# EAGLE design node (EAGLE 7.6.0)
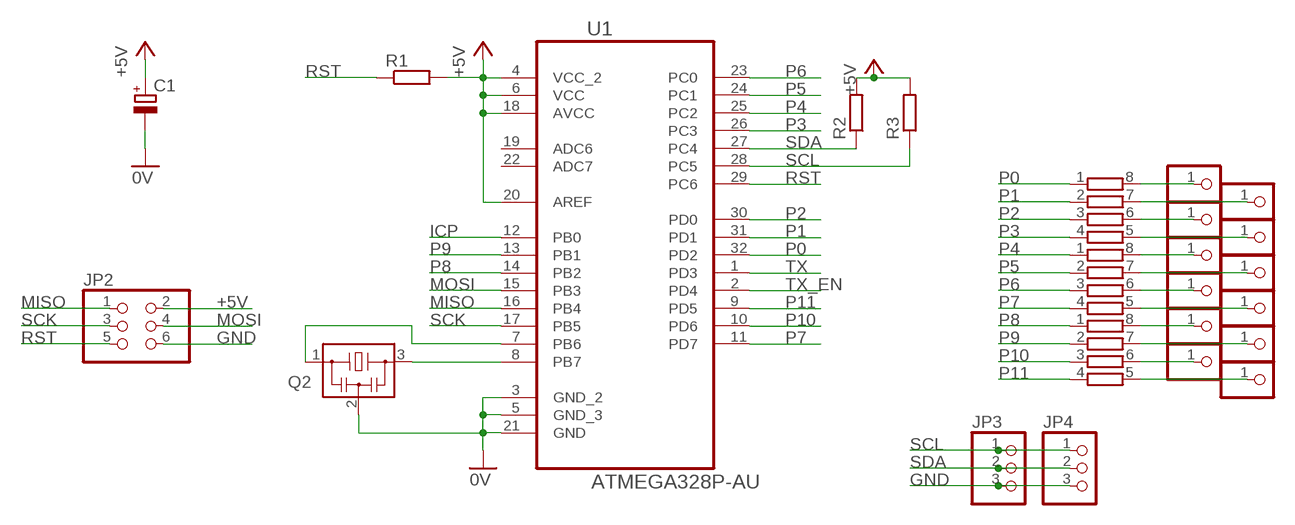
[diagram p0: schematic, sheet 1]

## Parts
C1  CPOL-EU153CLV-0405  [153CLV-0405]
JP1  PINHD-1X1  [1X01]
JP2  PINHD-2X3  [2X03]
JP3  PINHD-1X3  [1X03]
JP4  PINHD-1X3  [1X03]
JP6  PINHD-1X1  [1X01]
JP7  PINHD-1X1  [1X01]
JP8  PINHD-1X1  [1X01]
JP9  PINHD-1X1  [1X01]
JP10  PINHD-1X1  [1X01]
JP11  PINHD-1X1  [1X01]
JP12  PINHD-1X1  [1X01]
JP13  PINHD-1X1  [1X01]
JP14  PINHD-1X1  [1X01]
JP15  PINHD-1X1  [1X01]
JP16  PINHD-1X1  [1X01]
Q2  CSTCR6M00G53Z  [CSTCR6M]
R1  R-EU_R0402  [R0402]
R2  R-EU_R0402  [R0402]
R3  R-EU_R0402  [R0402]
RN1  4R-NEXB28V  [EXB28V]
RN2  4R-NEXB28V  [EXB28V]
RN3  4R-NEXB28V  [EXB28V]
U1  ATMEGA328P-AU  [QFP80P900X900X120-32N]

## Nets
+5V: C1.+ JP2.2 R1.2 R2.2 R3.2 U1.4(VCC_2) U1.6(VCC) U1.18(AVCC) U1.20(AREF)
GND: C1.- JP2.6 JP3.3 JP4.3 Q2.2 U1.3(GND_2) U1.5(GND_3) U1.21(GND) ; supply symbol labelled 0V
ICP: U1.12(PB0)
MISO: JP2.1 U1.16(PB4)
MOSI: JP2.4 U1.15(PB3)
N$1: Q2.3 U1.8(PB7)
N$2: Q2.1 U1.7(PB6)
N$3: JP1.1 RN1.8
N$4: JP16.1 RN1.7
N$5: JP6.1 RN1.6
N$6: JP15.1 RN1.5
N$7: JP7.1 RN2.8
N$8: JP14.1 RN2.7
N$9: JP8.1 RN2.6
N$10: JP13.1 RN2.5
N$11: JP9.1 RN3.8
N$12: JP12.1 RN3.7
N$13: JP10.1 RN3.6
N$14: JP11.1 RN3.5
P0: RN1.1 U1.32(PD2)
P1: RN1.2 U1.31(PD1)
P2: RN1.3 U1.30(PD0)
P3: RN1.4 U1.26(PC3)
P4: RN2.1 U1.25(PC2)
P5: RN2.2 U1.24(PC1)
P6: RN2.3 U1.23(PC0)
P7: RN2.4 U1.11(PD7)
P8: RN3.1 U1.14(PB2)
P9: RN3.2 U1.13(PB1)
P10: RN3.3 U1.10(PD6)
P11: RN3.4 U1.9(PD5)
RST: JP2.5 R1.1 U1.29(PC6)
SCK: JP2.3 U1.17(PB5)
SCL: JP3.1 JP4.1 R3.1 U1.28(PC5)
SDA: JP3.2 JP4.2 R2.1 U1.27(PC4)
TX: U1.1(PD3)
TX_EN: U1.2(PD4)
Unconnected: U1.19(ADC6) U1.22(ADC7)

## Library data of the parts
C1 = resistor:CPOL-EU: POLARIZED CAPACITOR, European symbol
JP1 JP6-JP16 = pinhead:PINHD-1X1: PIN HEADER
JP2 = pinhead:PINHD-2X3: PIN HEADER
JP3 JP4 = pinhead:PINHD-1X3: PIN HEADER
Q2 = murata-filter:CSTCR: Resonator Source: murata.co.jp; MPN: CSTCR6M00G53-R0; OC_FARNELL: 1170434; OC_NEWARK: 25M8759
R1-R3 = resistor:R-EU_: RESISTOR, European symbol
RN1-RN3 = resistor-dil:4R-N: Array Chip Resistor Source: RS Component / Phycomp; OC_FARNELL: unknown; OC_NEWARK: unknown
U1 = Atmel_By_element14_Batch_1-00:ATMEGA328P-AU: 8-bit Microcontroller with In-System Programmable Flash; MPN: ATMEGA328P-AU; OC_FARNELL: 1715486; OC_NEWARK: 14R4631; PACKAGE: TQFP-32; SUPPLIER: Atmel

## Board
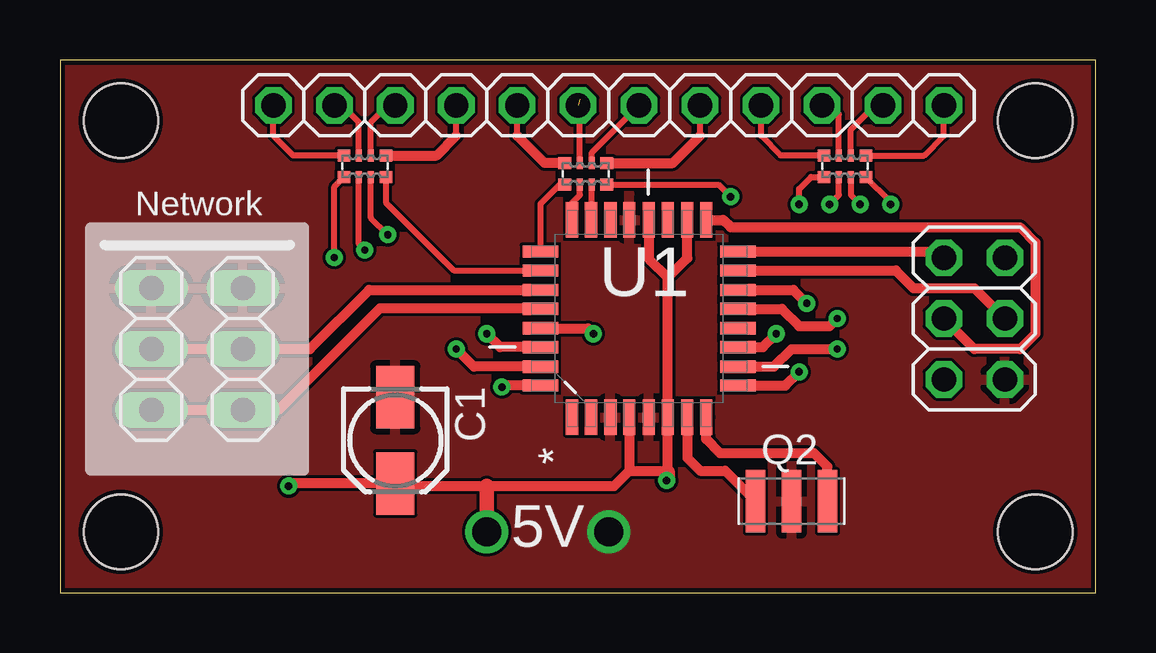
[diagram p1: board, top side]
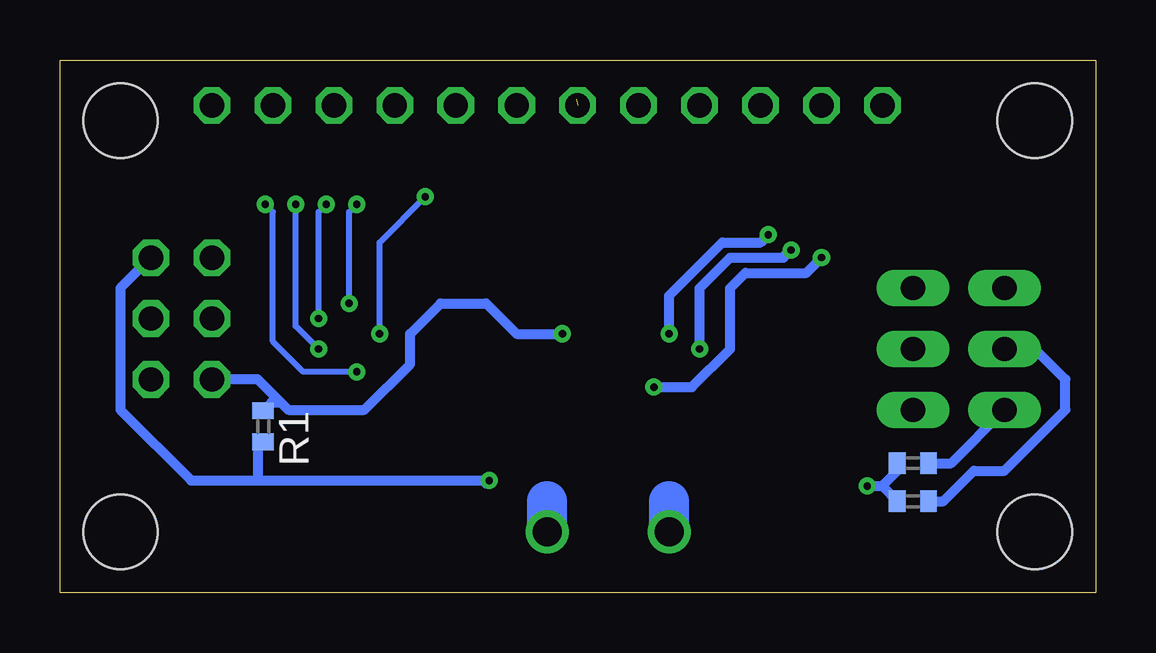
[diagram p2: board, bottom side, seen from below]

Size 43.16 x 22.21 mm. Coordinates in mm from the lower left corner, seen from the top.
Outline: 0,0 43.16,0 43.16,22.21 0,22.21 0,0
Copper layers (1*16): Top 0.035mm / dielectric 1.5mm / Bottom 0.035mm
Design rules "default *": minimum track width 5mil, minimum drill 0.3mm, track to track 5mil, track to pad 5mil, pad to pad 5mil, via to via 5mil, smd to smd 5mil, copper to edge 0.2mm, drill to drill 8mil, minimum pad ring 10mil, minimum via ring 8mil, stop-mask expansion 4mil, vias tented up to drill 15mil, thermal gap 10mil
Holes 3.1 mm at 2.54,2.54 40.64,2.54 40.64,19.68 2.54,19.68

### Footprints (pad centres in the part's own frame; a part is rotated, then mirrored left to right if it is on the bottom)
153CLV-0405 = smd 2.6 x 1.6: + 1.8,0; - -1.8,0
1X01 = drill 1.016 octagon: 1 0,0
2X03 = drill 1.016 octagon: 1 -2.54,-1.27; 2 -2.54,1.27; 3 0,-1.27; 4 0,1.27; 5 2.54,-1.27; 6 2.54,1.27
1X03 = drill 1.016 long: 1 -2.54,0; 2 0,0; 3 2.54,0
CSTCR6M = smd 0.8 x 2.6: 1 -1.5,0; 2 0,0; 3 1.5,0
R0402 = smd 0.7 x 0.9: 1 -0.65,0; 2 0.65,0
EXB28V = smd 0.525 x 0.5: 1 -0.875,-0.45; 4 0.875,-0.45; 5 0.875,0.45; 8 -0.875,0.45 | smd 0.25 x 0.5: 2 -0.25,-0.45; 3 0.25,-0.45; 6 0.25,0.45; 7 -0.25,0.45
QFP80P900X900X120-32N = smd 1.473 x 0.508: 1 -4.115,2.794; 2 -4.115,2.007; 3 -4.115,1.194; 4 -4.115,0.406; 5 -4.115,-0.406; 6 -4.115,-1.194; 7 -4.115,-2.007; 8 -4.115,-2.794; 17 4.115,-2.794; 18 4.115,-2.007; 19 4.115,-1.194; 20 4.115,-0.406; 21 4.115,0.406; 22 4.115,1.194; 23 4.115,2.007; 24 4.115,2.794 | smd 0.508 x 1.473: 9 -2.794,-4.115; 10 -2.007,-4.115; 11 -1.194,-4.115; 12 -0.406,-4.115; 13 0.406,-4.115; 14 1.194,-4.115; 15 2.007,-4.115; 16 2.794,-4.115; 25 2.794,4.115; 26 2.007,4.115; 27 1.194,4.115; 28 0.406,4.115; 29 -0.406,4.115; 30 -1.194,4.115; 31 -2.007,4.115; 32 -2.794,4.115

### Placement (x,y rotation side)
C1  13.97,6.35 270 top
JP1  8.89,20.32 0 top
JP2  38.1,11.43 270 top
JP3  3.81,10.16 90 top
JP4  7.62,10.16 90 top
JP6  13.97,20.32 0 top
JP7  19.05,20.32 0 top
JP8  24.13,20.32 0 top
JP9  29.21,20.32 0 top
JP10  34.29,20.32 0 top
JP11  36.83,20.32 0 top
JP12  31.75,20.32 0 top
JP13  26.67,20.32 0 top
JP14  21.59,20.32 0 top
JP15  16.51,20.32 0 top
JP16  11.43,20.32 0 top
Q2  30.48,3.81 0 top
R1  34.7,6.93 270 bottom
R2  7.62,3.81 180 bottom
R3  7.62,5.4 180 bottom
RN1  12.7,17.78 0 top
RN2  21.91,17.46 0 top
RN3  32.7,17.78 0 top
U1  24.13,11.43 90 top

### Tracks (layer width: path | path; a pad name or v marks a point on that pad's centre or on a via)
+5V  (via drill 0.3, 1.2)
  Top 0.406: 25.4,5.08 25.32,5.16 U1.6 25.32,13.13 | 25.32,13.13 26.14,13.95 U1.18 | U1.20 24.54,13.92 25.32,13.13 | 23.72,5.08 25.4,5.08 | U1.4 23.72,5.08 | 25.4,5.08 25.4,4.8 v25.27,4.67 | C1.+ | C1.+ 14.07,4.45 17.78,4.45 23.09,4.45 23.72,5.08 | C1.+ 9.63,4.55 v9.53,4.45
  Top 0.61: v17.78,2.54 17.78,4.45
  Bottom 0.406: 25.4,4.55 v25.27,4.67 34.92,4.67 | JP2.2 40.64,12.7 40.64,7.62 37.69,4.67 34.92,4.67 | R1.2 34.92,6.06 34.92,4.67 | v9.53,4.45 8.9,4.45 | 8.9,4.45 R2.2 | R3.2 8.27,5.08 8.9,4.45
  Bottom 1.676: v17.78,2.54 17.78,3.81
GND  (via drill 1.2)
  Bottom 1.676: v22.86,2.54 22.86,3.81
  pour Top: 43.18,23.5 0,23.5 0,0 43.18,0
MISO
  Top 0.406: U1.16 36.58,14.22 JP2.1
MOSI
  Top 0.406: U1.15 34.82,13.44 35.56,12.7 38.1,12.7 JP2.4
N$1
  Top 0.406: 26.98,7.32 U1.8 26.92,6.4 27.51,5.82 31.42,5.82 31.98,5.26 Q2.3
N$2
  Top 0.406: U1.7 26.14,5.61 26.67,5.08 27.71,5.08 Q2.1
N$3
  Top 0.254: RN1.8 9.71,18.23 8.89,19.05 JP1.1
N$4
  Top 0.254: RN1.7 12.45,19.62 11.75,20.32 JP16.1
N$5
  Top 0.254: RN1.6 12.95,19.62 13.65,20.32 JP6.1
N$6
  Top 0.254: 16.51,19.05 JP15.1
  Top 0.406: RN1.5 15.69,18.23 16.51,19.05
N$7
  Top 0.254: 19.05,19.05 JP7.1
  Top 0.406: RN2.8 20.19,17.91 19.05,19.05
N$8  (1 unrouted)
  Top 0.254: RN2.7 21.66,20.57
N$9
  Top 0.254: RN2.6 22.16,18.35 JP8.1
N$10
  Top 0.254: 26.67,19.05 JP13.1
  Top 0.406: RN2.5 25.53,17.91 26.67,19.05
N$11
  Top 0.254: RN3.8 30.03,18.23 29.21,19.05 JP9.1
N$12
  Top 0.254: RN3.7 32.45,19.93 32.07,20.32 JP12.1
N$13
  Top 0.254: RN3.6 32.95,19.3 33.97,20.32 JP10.1
N$14
  Top 0.254: RN3.5 36.01,18.23 36.83,19.05 JP11.1
P0  (via drill 0.3)
  Top 0.254: v11.43,13.97 11.43,16.93 RN1.1
  Top 0.406: U1.32 18.48,8.64 v18.41,8.57
  Bottom 0.406: v18.41,8.57 16.83,8.57 15.24,10.16 15.24,12.7 14.61,13.34 12.06,13.34 v11.43,13.97
P1  (via drill 0.3)
  Top 0.254: v12.7,14.29 12.45,14.54 RN1.2
  Top 0.406: U1.31 17.25,9.42 v16.51,10.16
  Bottom 0.406: v16.51,10.16 16.51,12.7 15.24,13.97 13.02,13.97 v12.7,14.29
P2  (via drill 0.3)
  Top 0.254: v13.65,14.92 12.95,15.62 RN1.3
  Top 0.406: U1.30 18.34,10.24 v17.78,10.79
  Bottom 0.406: v17.78,10.79 17.78,12.38 15.56,14.61 13.97,14.61 v13.65,14.92
P3
  Top 0.254: RN1.4 13.57,16.27 16.41,13.44 U1.26
P4
  Top 0.254: RN2.1 20.82,17.01 20.02,16.21 U1.25
P5
  Top 0.254: U1.24 21.34,16.26 21.66,16.58 RN2.2
P6
  Top 0.254: U1.23 22.16,15.58 RN2.3
P7  (via drill 0.3)
  Top 0.254: RN2.4 27.44,17.01 v27.94,16.51
  Top 0.406: U1.11 29.29,10.24 v29.84,10.79
  Bottom 0.254: v29.84,10.79 29.84,14.61 v27.94,16.51
P8  (via drill 0.3)
  Top 0.254: v30.8,16.19 30.8,16.83 31.3,17.33 RN3.1
  Top 0.406: U1.14 30.56,12.62 v31.11,12.07
  Bottom 0.254: v31.11,12.07 31.11,15.88 v30.8,16.19
P9  (via drill 0.3)
  Top 0.254: v32.07,16.19 32.45,16.58 RN3.2
  Top 0.406: U1.13 30.07,11.84 30.8,11.11 32.07,11.11 v32.38,11.43
  Bottom 0.254: v32.38,11.43 32.38,15.88 v32.07,16.19
P10  (via drill 0.3)
  Top 0.254: RN3.3 32.95,16.58 v33.34,16.19
  Top 0.406: U1.10 29.74,9.42 30.48,10.16 v32.38,10.16
  Bottom 0.254: v32.38,10.16 33.34,11.11 v33.34,16.19
P11  (via drill 0.3)
  Top 0.254: v34.61,16.19 34.61,16.3 RN3.4
  Top 0.406: U1.9 30.23,8.64 v30.8,9.21
  Bottom 0.254: v30.8,9.21 33.02,9.21 34.29,10.48 34.29,15.88 v34.61,16.19
RST  (via drill 0.3)
  Top 0.406: U1.29 22,11.02 v22.23,10.79
  Bottom 0.406: JP2.5 34.92,8.89 33.97,7.94 | 33.97,7.94 33.66,7.62 30.48,7.62 28.57,9.53 28.57,10.79 27.3,12.07 25.4,12.07 24.13,10.79 v22.23,10.79 | R1.1 34.34,7.94 33.97,7.94
SCK
  Top 0.406: U1.17 27.64,15.55 27.94,15.24 40.01,15.24 40.64,14.61 40.64,10.79 40.01,10.16 38.1,10.16 JP2.3
SCL
  Top 0.406: JP3.1 JP4.1 9.09,7.62 13.34,11.86 19.99,11.86 U1.28
  Bottom 0.406: R3.1 6.03,5.4 JP3.1
SDA
  Top 0.406: JP3.2 JP4.2 10.41,10.16 12.88,12.62 U1.27
  Bottom 0.406: JP3.2 2.54,10.16 1.27,8.89 1.27,7.62 3.81,5.08 5.08,5.08 6.35,3.81 R2.1

### Text on the board
tNames: Network | 5V
tValues: + | -